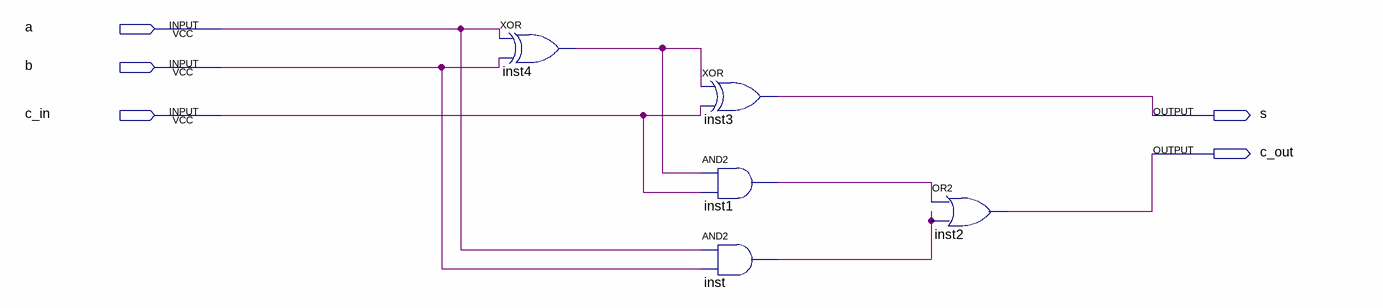
[diagram p0: schematic sheet]
// Quartus schematic full_adder_1_bit.bdf as structural Verilog: 5 symbols, 5 pins
module full_adder_1_bit (
  input  a,
  input  b,
  input  c_in,
  output s,
  output c_out
);

  wire inst1_out, inst4_out, inst_out;

  xor inst4 (inst4_out, a, b);
  xor inst3 (s, inst4_out, c_in);
  and inst1 (inst1_out, inst4_out, c_in);
  and inst (inst_out, a, b);
  or inst2 (c_out, inst1_out, inst_out);
endmodule
